# Altium schematic sheet Interface_DS18B20.SchDoc
size A4
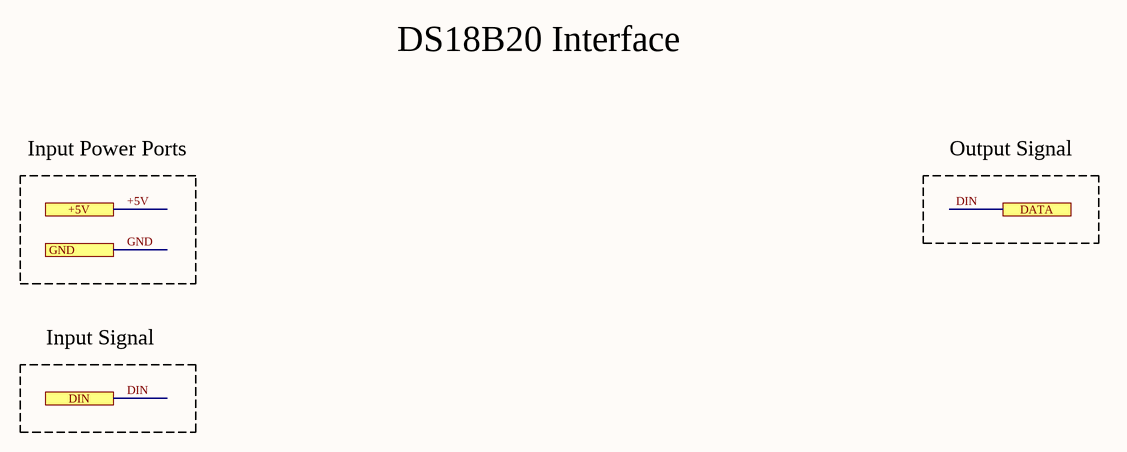
[diagram p0: Interface_DS18B20.SchDoc]

## Ports
+5V, DATA, DIN, GND

## Nets
+5V: port +5V
DIN: port DATA, port DIN
GND: port GND

## Notes on the sheet
- DS18B20 Interface
- Input Power Ports
- Output Signal
- Input Signal